# Altium schematic sheet blue_pill.SchDoc
size A4; SheetNumber: 1; SheetTotal: 8
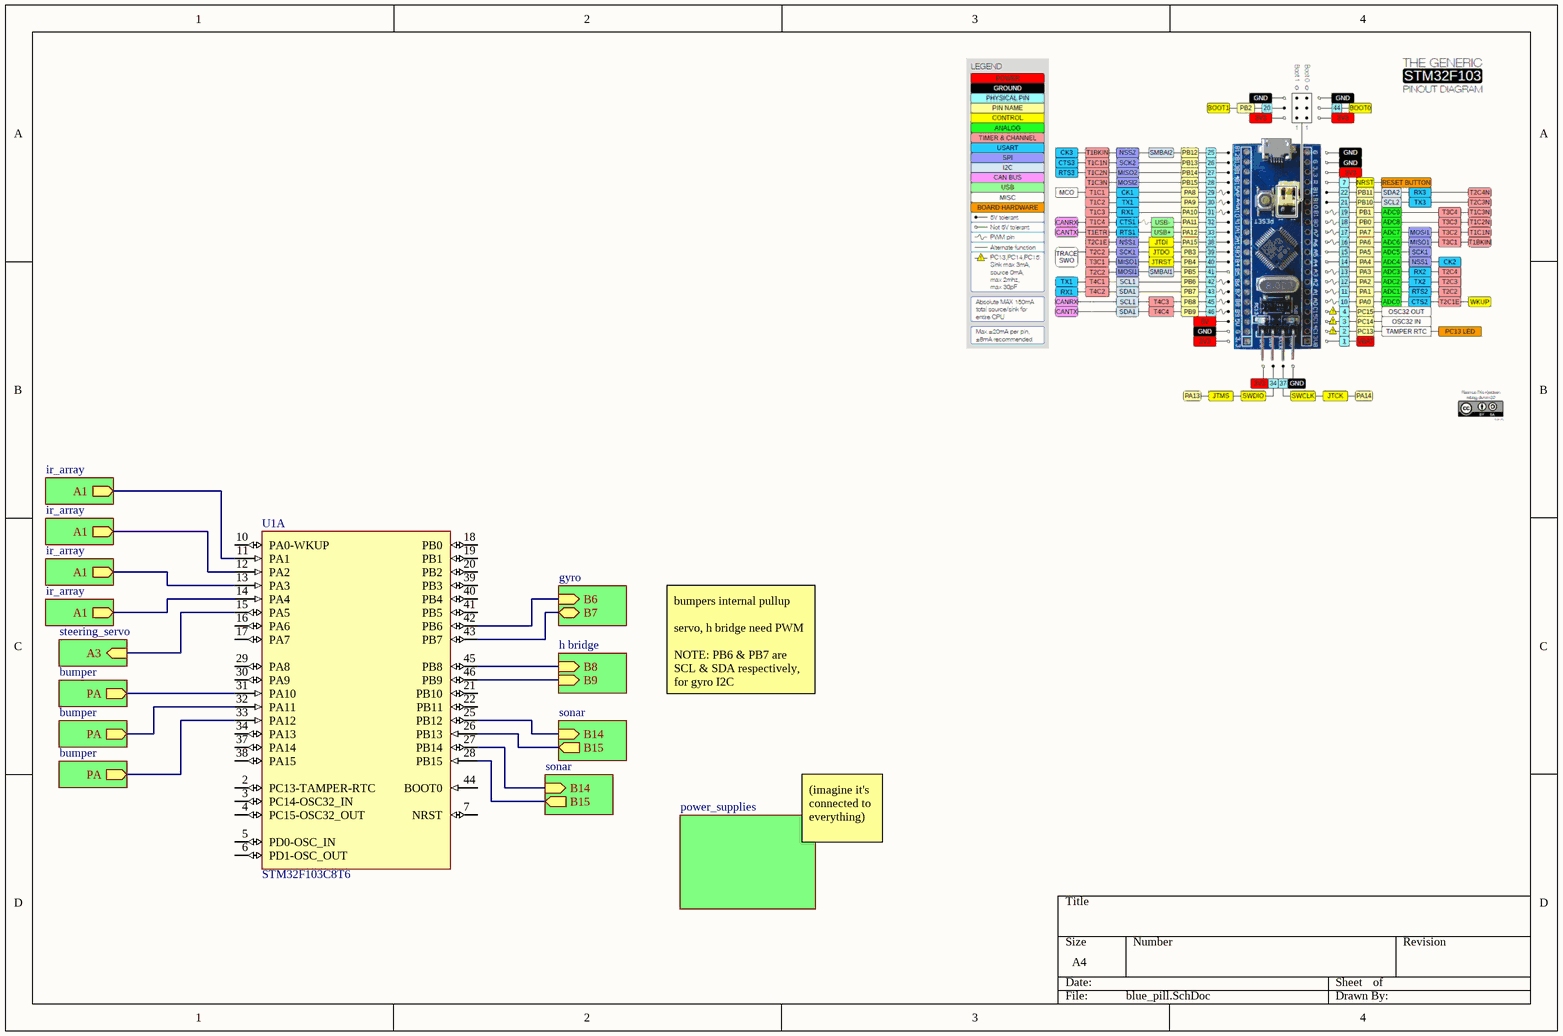
[diagram p0: blue_pill.SchDoc]

## Parts
U1  STM32F103C8T6  [STM-LQFP48_L]  (part A of 2)

## Sub-sheets
Designator = ir_array: A1 (out)
Designator = power_supplies: no entries
Designator = bumper: PA (out)
Designator = bumper: PA (out)
Designator = bumper: PA (out)
Designator = gyro: B6 (in), B7 (bidir)
Designator = sonar: B14 (in), B15 (out)
Designator = sonar: B14 (in), B15 (out)
Designator = h bridge: B8 (in), B9 (in)
Designator = ir_array: A1 (out)
Designator = steering_servo: A3 (in)
Designator = ir_array: A1 (out)
Designator = ir_array: A1 (out)

## Nets
NetU1_11: U1.11(PA1) ; sheet Designator/A1
NetU1_12: U1.12(PA2) ; sheet Designator/A1
NetU1_13: U1.13(PA3) ; sheet Designator/A1
NetU1_14: U1.14(PA4) ; sheet Designator/A1
NetU1_15: U1.15(PA5) ; sheet Designator/A3
NetU1_25: U1.25(PB12) ; sheet Designator/B14
NetU1_26: U1.26(PB13) ; sheet Designator/B15
NetU1_27: U1.27(PB14) ; sheet Designator/B14
NetU1_28: U1.28(PB15) ; sheet Designator/B15
NetU1_31: U1.31(PA10) ; sheet Designator/PA
NetU1_32: U1.32(PA11) ; sheet Designator/PA
NetU1_33: U1.33(PA12) ; sheet Designator/PA
NetU1_42: U1.42(PB6) ; sheet Designator/B6
NetU1_43: U1.43(PB7) ; sheet Designator/B7
NetU1_45: U1.45(PB8) ; sheet Designator/B8
NetU1_46: U1.46(PB9) ; sheet Designator/B9

Not connected (* = marked no-connect by the designer): U1 2(PC13-TAMPER-RTC) 3(PC14-OSC32_IN) 4(PC15-OSC32_OUT) 5(PD0-OSC_IN) 6(PD1-OSC_OUT) 7(NRST) 10(PA0-WKUP) 16(PA6) 17(PA7) 18(PB0) 19(PB1) 20(PB2) 21(PB10) 22(PB11) 29(PA8) 30(PA9) 34(PA13) 37(PA14) 38(PA15) 39(PB3) 40(PB4) 41(PB5) 44(BOOT0)

## Notes on the sheet
- bumpers internal pullup
  servo, h bridge need PWM
  NOTE: PB6 & PB7 are SCL & SDA respectively, for gyro I2C
- (imagine it's connected to everything)

## Library data of the parts
U1 = CMP-0237-00215-3: ARM Cortex-M3 32-bit MCU, 64 KB Flash, 20 KB Internal RAM, 37 I/Os, 48-pin LQFP, -40 to 85 degC, Tray; Supply Voltage(Vcc) min (V): 2; Internal RAM Size (kB): 20; FLASH Size (Prog) (kB): 64; A/D Converter: 2x12-bit (10 Channel); I/Os (High Current): 37; Operating Frequency(F) (Processor speed) (MHz): 72; Core: ARM Cortex-M3; ComponentLink3Description: Package Specification; Mounting Technology: Surface Mount; PartNumber: STM32F103C8T6; PackageReference: LQFP48; Packing: Tray; ComponentLink3URL: http://www.st.com/st-web-ui/static/active/en/resource/technical/document/datasheet/DM00058181.pdf; DatasheetVersion: Rev. 16; ComponentLink1URL: http://www.st.com/web/en/home.html; PackageVersion: Rev. 6, 06/2013; ComponentLink2URL: http://www.st.com/st-web-ui/static/active/en/resource/technical/document/datasheet/CD00161566.pdf; ComponentLink1Description: Manufacturer URL; ComponentLink2Description: Datasheet; PackageDescription: 48-Pin Low Profile Quad Flat Package, 7 x 7 mm Body, 0.5 mm Pitch